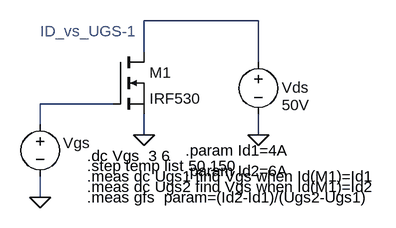
[diagram p0: schematic ID_vs_UGS-1.asc]
ID_vs_UGS-1.asc, the LTspice schematic file:
Version 4
SHEET 1 1292 680
WIRE -544 -176 -720 -176
WIRE -720 -128 -720 -176
WIRE -544 -112 -544 -176
WIRE -768 -48 -880 -48
WIRE -880 -16 -880 -48
WIRE -720 0 -720 -32
WIRE -544 0 -544 -32
WIRE -880 96 -880 64
FLAG -544 0 0
FLAG -880 96 0
FLAG -720 0 0
SYMBOL voltage -544 -128 R0
WINDOW 123 0 0 Left 2
WINDOW 39 37 60 Left 2
WINDOW 0 36 55 Left 2
WINDOW 3 36 82 Left 2
SYMATTR InstName Vds
SYMATTR Value 50V
SYMBOL voltage -880 -32 R0
WINDOW 123 0 0 Left 2
WINDOW 39 40 53 Left 2
WINDOW 3 -97 181 Left 2
WINDOW 0 35 44 Left 2
SYMATTR Value ""
SYMATTR InstName Vgs
SYMBOL nmos -768 -128 R0
SYMATTR InstName M1
SYMATTR Value IRF530
TEXT -808 32 Left 2 !.dc Vgs  3 6
TEXT -880 -160 Left 2 ;ID_vs_UGS-1
TEXT -808 48 Left 2 !.step temp list 50 150
TEXT -808 64 Left 2 !.meas dc Ugs1 find Vgs when Id(M1)=Id1
TEXT -808 80 Left 2 !.meas dc Ugs2 find Vgs when Id(M1)=Id2
TEXT -808 96 Left 2 !.meas gfs  param=(Id2-Id1)/(Ugs2-Ugs1)
TEXT -656 24 Left 2 !.param Id1=4A\n.param Id2=6A

The netlist it stands for:
* ID_vs_UGS-1.asc
Vds N001 0 50V
Vgs N002 0
M1 N001 N002 0 0 IRF530
.model NMOS NMOS
.model PMOS PMOS
.lib standard.mos
.dc Vgs  3 6
* ID_vs_UGS-1
.step temp list 50 150
.meas dc Ugs1 find Vgs when Id(M1)=Id1
.meas dc Ugs2 find Vgs when Id(M1)=Id2
.meas gfs  param=(Id2-Id1)/(Ugs2-Ugs1)
.param Id1=4A
.param Id2=6A
.backanno
.end